# Altium schematic sheet LB-word-charInput.SchDoc
size A4
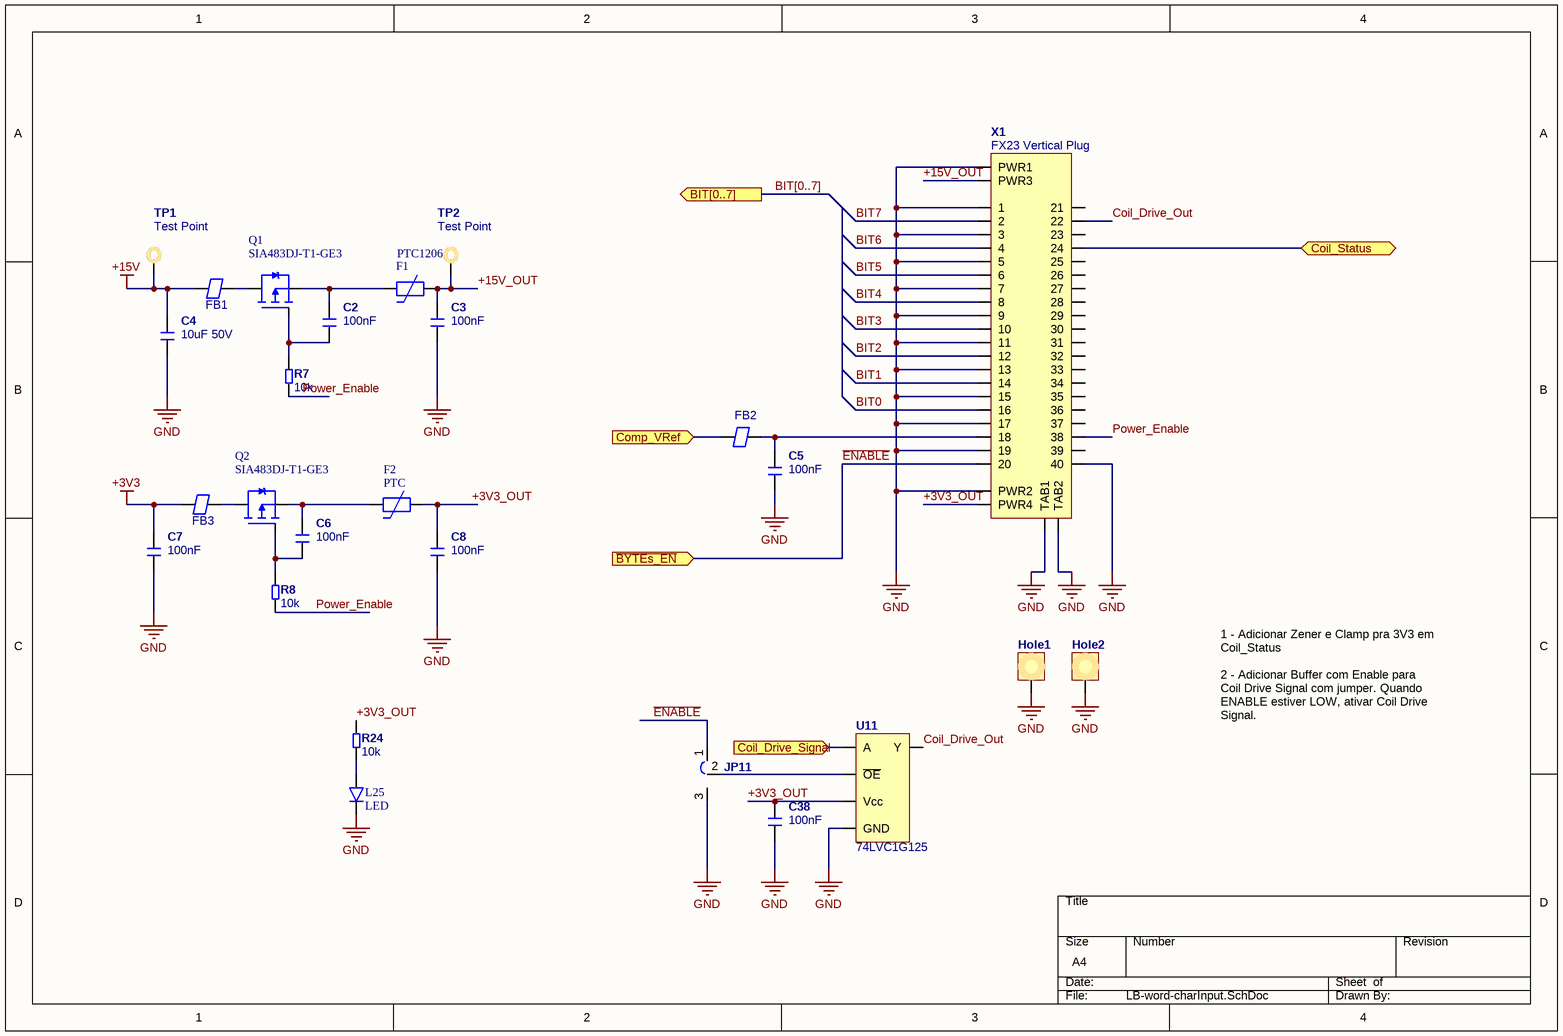
[diagram p0: LB-word-charInput.SchDoc]

## Parts
C2  100nF  [C0603_N]
C3  100nF  [C0603_N]
C4  10uF 50V  [C1210_N]
C5  100nF  [C0603_N]
C6  100nF  [C0603_N]
C7  100nF  [C0603_N]
C8  100nF  [C0603_N]
C38  100nF  [C0603_N]
F1  PTC1206  [C1206_N]
F2  PTC  [PTC0603]
FB1  FB  [F0603_N]  (value not drawn)
FB2  FB  [F0603_N]  (value not drawn)
FB3  FB  [F0603_N]  (value not drawn)
Hole1  (no value)  [M3 Plated Hole]
Hole2  (no value)  [M3 Plated Hole]
JP11  Jumper 3W  [Jumper SMD 3W NO]  (value not drawn)
L25  LED  [LED 0603/1608]
Q1  SIA483DJ-T1-GE3  [SC70-6L]
Q2  SIA483DJ-T1-GE3  [SC70-6L]
R7  10k  [R0603]
R8  10k  [R0603]
R24  10k  [R0603]
TP1  Test Point  [TestPoint-1.2mm]
TP2  Test Point  [TestPoint-1.2mm]
U11  74LVC1G125  [SC70-5]
X1  FX23 Vertical Plug  [FX23-40P]

## Ports
BIT[0..7] (out), Coil_Drive_Signal (in), Coil_Status (bidir), Comp_VRef (in), ~{BYTEs_EN} (in)

## Nets
+3V3: C7.1 FB3.1
+15V: C4.1 FB1.1 TP1.1
GND: C3.2 C4.2 C5.2 C7.2 C8.2 C38.2 Hole1.1 Hole2.1 JP11.3 L25.1(K) U11.3(GND) X1.1 X1.3 X1.5 X1.7 X1.9 X1.11 X1.13 X1.15 X1.17 X1.19 X1.40 X1.PWR1 X1.PWR2 X1.TAB1 X1.TAB2
+3V3_OUT: C8.1 C38.1 F2.2 R24.2 U11.5(Vcc) X1.PWR4
+15V_OUT: C3.1 F1.2 TP2.1 X1.PWR3
~{ENABLE}: JP11.1 X1.20 ; port ~{BYTEs_EN}
BIT0: X1.16
BIT1: X1.14
BIT2: X1.12
BIT3: X1.10
BIT4: X1.8
BIT5: X1.6
BIT6: X1.4
BIT7: X1.2
Coil_Drive_Out: U11.4(Y) X1.22
Coil_Drive_Signal: U11.2(A) ; port Coil_Drive_Signal
Coil_Status: X1.24 ; port Coil_Status
Comp_VRef: FB2.1 ; port Comp_VRef
Power_Enable: R7.1 R8.1 X1.38
NetC2_1: C2.1 F1.1 Q1.S
NetC2_2: C2.2 Q1.G R7.2
NetC5_1: C5.1 FB2.2 X1.18
NetC6_1: C6.1 F2.1 Q2.S
NetC6_2: C6.2 Q2.G R8.2
NetFB1_2: FB1.2 Q1.D
NetFB3_2: FB3.2 Q2.D
NetJP11_2: JP11.2 U11.1(~{OE})
NetL25_2: L25.2(A) R24.1

Not connected (* = marked no-connect by the designer): X1 21 23 25 26 27 28 29 30 31 32 33 34 35 36 37 39

## Buses and harness runs
bus BIT[0..7] = port BIT[0..7]

## Notes on the sheet
- 1 - Adicionar Zener e Clamp pra 3V3 em Coil_Status
  2 - Adicionar Buffer com Enable para Coil Drive Signal com jumper. Quando ENABLE estiver LOW, ativar Coil Drive Signal.

## Library data of the parts
C2-C8 C38 = Capacitor: Capacitor MLCC; Manufacturer: Yageo; Manufacturer Part Number: CC0603KRX7R9BB104; Tolerance (%): 10; Category: Capacitor; Package: 0603; Supplier Part Number 1: 1362556; Supplier 1: Farnell; ComponentLink1URL: http://www.yageo.com; ComponentLink1Description: Manufacturer Website; Voltage Rating (Volts): *; Supplier 2: Digi-Key; Supplier Part Number 2: 311-1344-1-ND
  C2 C3 C5-C8 C38: Value: 100nF
  C4: Value: 10uF 50V
F1 F2 = PTC: PTC, Resettable Fuse
FB1-FB3 = Ferrite Bead
Hole1 Hole2 = Hole: Footprint: =Footprint
Q1 Q2 = MOSFET P CH
R7 R8 R24 = Resistor: Published: 17-Dec-2003; LatestRevisionDate: 19-Mar-2004; LatestRevisionNote: Silkscreen size reduced.; PackageDocument: Mar-2003; PackageReference: 3-0603; Publisher: Altium Limited; Code_IPC: 1608 [0603]; ComponentLink1Description: Manufacturer Link; ComponentLink1URL: http://www.panasonic.com/industrial/components/resistive_products.htm; ComponentLink2Description: Datasheet; ComponentLink2URL: http://www.panasonic.com/industrial/components/pdf/AOA0000CE2.pdf; Value: 10k
U11 = 74LVC1G125: Buffer with Enable
X1 = FX23-40P